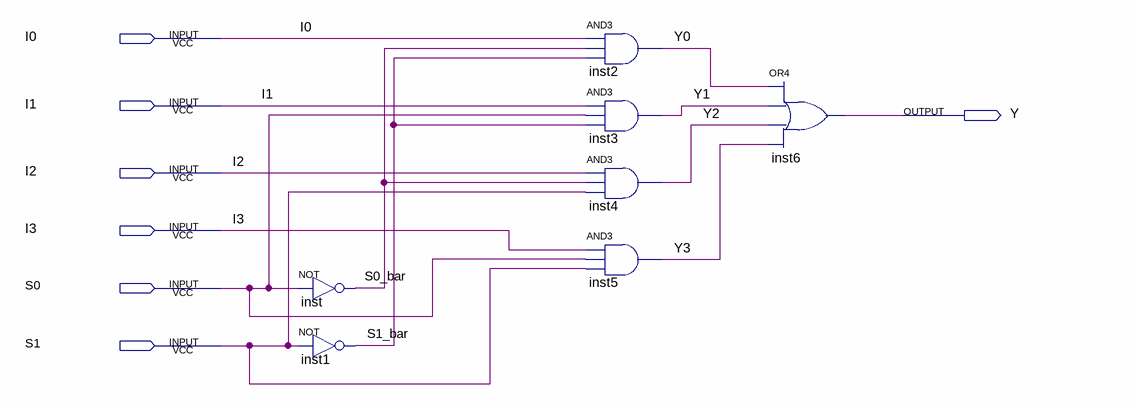
[diagram p0: schematic sheet]
// Quartus schematic Mux.bdf as structural Verilog: 7 symbols, 7 pins
module Mux (
  input  I0,
  input  I1,
  input  I2,
  input  I3,
  input  S0,
  input  S1,
  output Y
);

  wire S0_bar, S1_bar, Y0, Y1, Y2, Y3;

  not inst (S0_bar, S0);
  not inst1 (S1_bar, S1);
  and inst2 (Y0, I0, S0_bar, S1_bar);
  and inst3 (Y1, I1, S0, S1_bar);
  and inst4 (Y2, I2, S0_bar, S1);
  and inst5 (Y3, I3, S0, S1);
  or inst6 (Y, Y0, Y1, Y2, Y3);
endmodule
